# Altium schematic sheet Baikal_top.SchDoc: =ProjectName
size 420 x 297 mm; Author: SBH; CompanyName: WUT; DrawnBy: SBH; Organization: ISE-WUT; Address1: Warsaw Univeristy of Technology; Address2: Nowowiejska 15/19; DocumentNumber: 1; Revision: -; SheetNumber: 1; SheetTotal: 12; EDA_Number: ARTIQ; Projet: eRTM15 Baikal; ModifiedBy: -; CreateDate: XX/XX/XXXX; CheckedDate: -; Title2: Baikal_top.SchDoc; DivGrp: ISE; Designer: SBH; ModifiedDate: -; ProjectName: eRTM15 Baikal
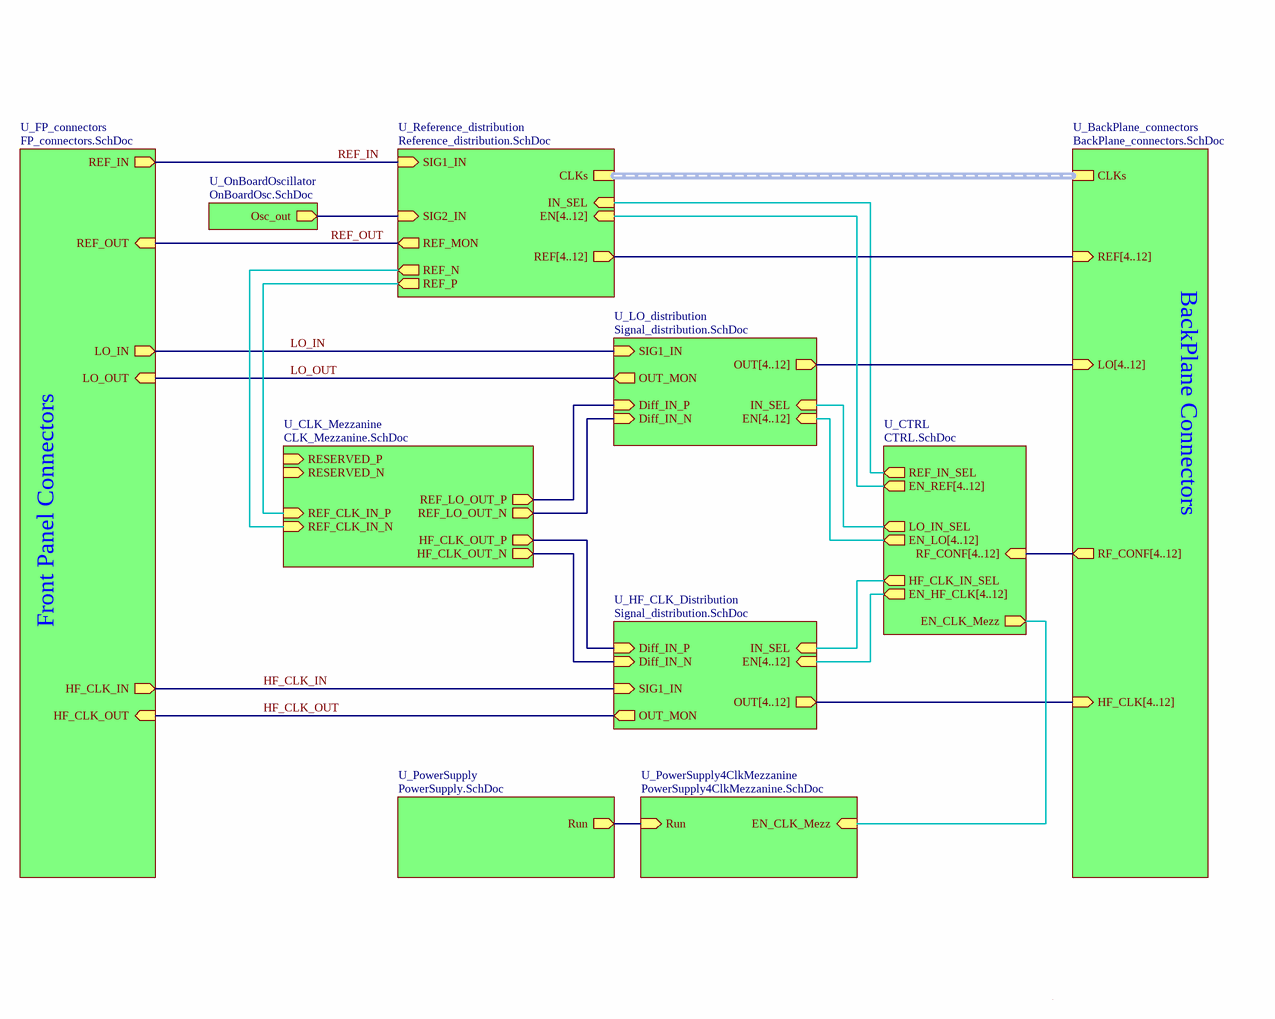
[diagram p0: Baikal_top.SchDoc]

## Sub-sheets
U_BackPlane_connectors = BackPlane_connectors.SchDoc: LO[4..12] (in), HF_CLK[4..12] (in), RF_CONF[4..12] (out), CLKs (harness CLKs), REF[4..12] (in)
U_CLK_Mezzanine = CLK_Mezzanine.SchDoc: RESERVED_P (in), RESERVED_N (in), REF_CLK_IN_P (in), REF_CLK_IN_N (in), HF_CLK_OUT_P (out), HF_CLK_OUT_N (out), REF_LO_OUT_P (out), REF_LO_OUT_N (out)
U_CTRL = CTRL.SchDoc: EN_HF_CLK[4..12] (out), EN_LO[4..12] (out), EN_REF[4..12] (out), RF_CONF[4..12] (in), REF_IN_SEL (out), LO_IN_SEL (out), HF_CLK_IN_SEL (out), EN_CLK_Mezz (out)
U_FP_connectors = FP_connectors.SchDoc: LO_OUT (in), HF_CLK_IN (out), HF_CLK_OUT (in), REF_IN (out), REF_OUT (in), LO_IN (out)
U_HF_CLK_Distribution = Signal_distribution.SchDoc: SIG1_IN (in), IN_SEL (in), OUT[4..12] (out), OUT_MON (out), Diff_IN_N (in), Diff_IN_P (in), EN[4..12] (in)
U_LO_distribution = Signal_distribution.SchDoc: SIG1_IN (in), IN_SEL (in), OUT[4..12] (out), OUT_MON (out), Diff_IN_N (in), Diff_IN_P (in), EN[4..12] (in)
U_OnBoardOscillator = OnBoardOsc.SchDoc: Osc_out (out)
U_PowerSupply = PowerSupply.SchDoc: Run (out)
U_PowerSupply4ClkMezzanine = PowerSupply4ClkMezzanine.SchDoc: EN_CLK_Mezz (in), Run (in)
U_Reference_distribution = Reference_distribution.SchDoc: SIG1_IN (in), SIG2_IN (in), IN_SEL (in), CLKs (harness CLKs), REF[4..12] (out), REF_MON (out), EN[4..12] (in), REF_P (out), REF_N (out)

## Nets
HF_CLK_IN: sheet U_FP_connectors/HF_CLK_IN, sheet U_HF_CLK_Distribution/SIG1_IN
HF_CLK_OUT: sheet U_FP_connectors/HF_CLK_OUT, sheet U_HF_CLK_Distribution/OUT_MON
LO_IN: sheet U_FP_connectors/LO_IN, sheet U_LO_distribution/SIG1_IN
LO_OUT: sheet U_FP_connectors/LO_OUT, sheet U_LO_distribution/OUT_MON
REF_IN: sheet U_FP_connectors/REF_IN, sheet U_Reference_distribution/SIG1_IN
REF_OUT: sheet U_FP_connectors/REF_OUT, sheet U_Reference_distribution/REF_MON
(unnamed): sheet U_PowerSupply/Run, sheet U_PowerSupply4ClkMezzanine/Run
(unnamed): sheet U_CLK_Mezzanine/REF_CLK_IN_P, sheet U_Reference_distribution/REF_P
(unnamed): sheet U_CLK_Mezzanine/REF_CLK_IN_N, sheet U_Reference_distribution/REF_N
(unnamed): sheet U_CLK_Mezzanine/HF_CLK_OUT_P, sheet U_HF_CLK_Distribution/Diff_IN_P
(unnamed): sheet U_CLK_Mezzanine/HF_CLK_OUT_N, sheet U_HF_CLK_Distribution/Diff_IN_N
(unnamed): sheet U_CLK_Mezzanine/REF_LO_OUT_P, sheet U_LO_distribution/Diff_IN_P
(unnamed): sheet U_CLK_Mezzanine/REF_LO_OUT_N, sheet U_LO_distribution/Diff_IN_N
(unnamed): sheet U_Reference_distribution/SIG2_IN, sheet U_OnBoardOscillator/Osc_out
(unnamed): sheet U_Reference_distribution/IN_SEL, sheet U_CTRL/REF_IN_SEL
(unnamed): sheet U_LO_distribution/IN_SEL, sheet U_CTRL/LO_IN_SEL
(unnamed): sheet U_HF_CLK_Distribution/IN_SEL, sheet U_CTRL/HF_CLK_IN_SEL
(unnamed): sheet U_CTRL/EN_CLK_Mezz, sheet U_PowerSupply4ClkMezzanine/EN_CLK_Mezz

## Buses and harness runs
bus sheet U_BackPlane_connectors/HF_CLK[4..12] = sheet U_HF_CLK_Distribution/OUT[4..12]
bus sheet U_BackPlane_connectors/LO[4..12] = sheet U_LO_distribution/OUT[4..12]
bus sheet U_BackPlane_connectors/REF[4..12] = sheet U_Reference_distribution/REF[4..12]
bus sheet U_BackPlane_connectors/RF_CONF[4..12] = sheet U_CTRL/RF_CONF[4..12]
bus sheet U_CTRL/EN_HF_CLK[4..12] = sheet U_HF_CLK_Distribution/EN[4..12]
bus sheet U_CTRL/EN_LO[4..12] = sheet U_LO_distribution/EN[4..12]
bus sheet U_CTRL/EN_REF[4..12] = sheet U_Reference_distribution/EN[4..12]
harness sheet U_BackPlane_connectors/CLKs = sheet U_Reference_distribution/CLKs

## Notes on the sheet
- BackPlane Connectors
- Front Panel Connectors
- Project/Equipment
- Document
- Designer
- Drawn by
- Check.by
- File
- Last Mod.
- Print Date
- Sheet
- Size
- A3
- of
- Rev